# Altium schematic sheet Actuators.SchDoc: Actuators
size A3; SheetNumber: 5; SheetTotal: 10
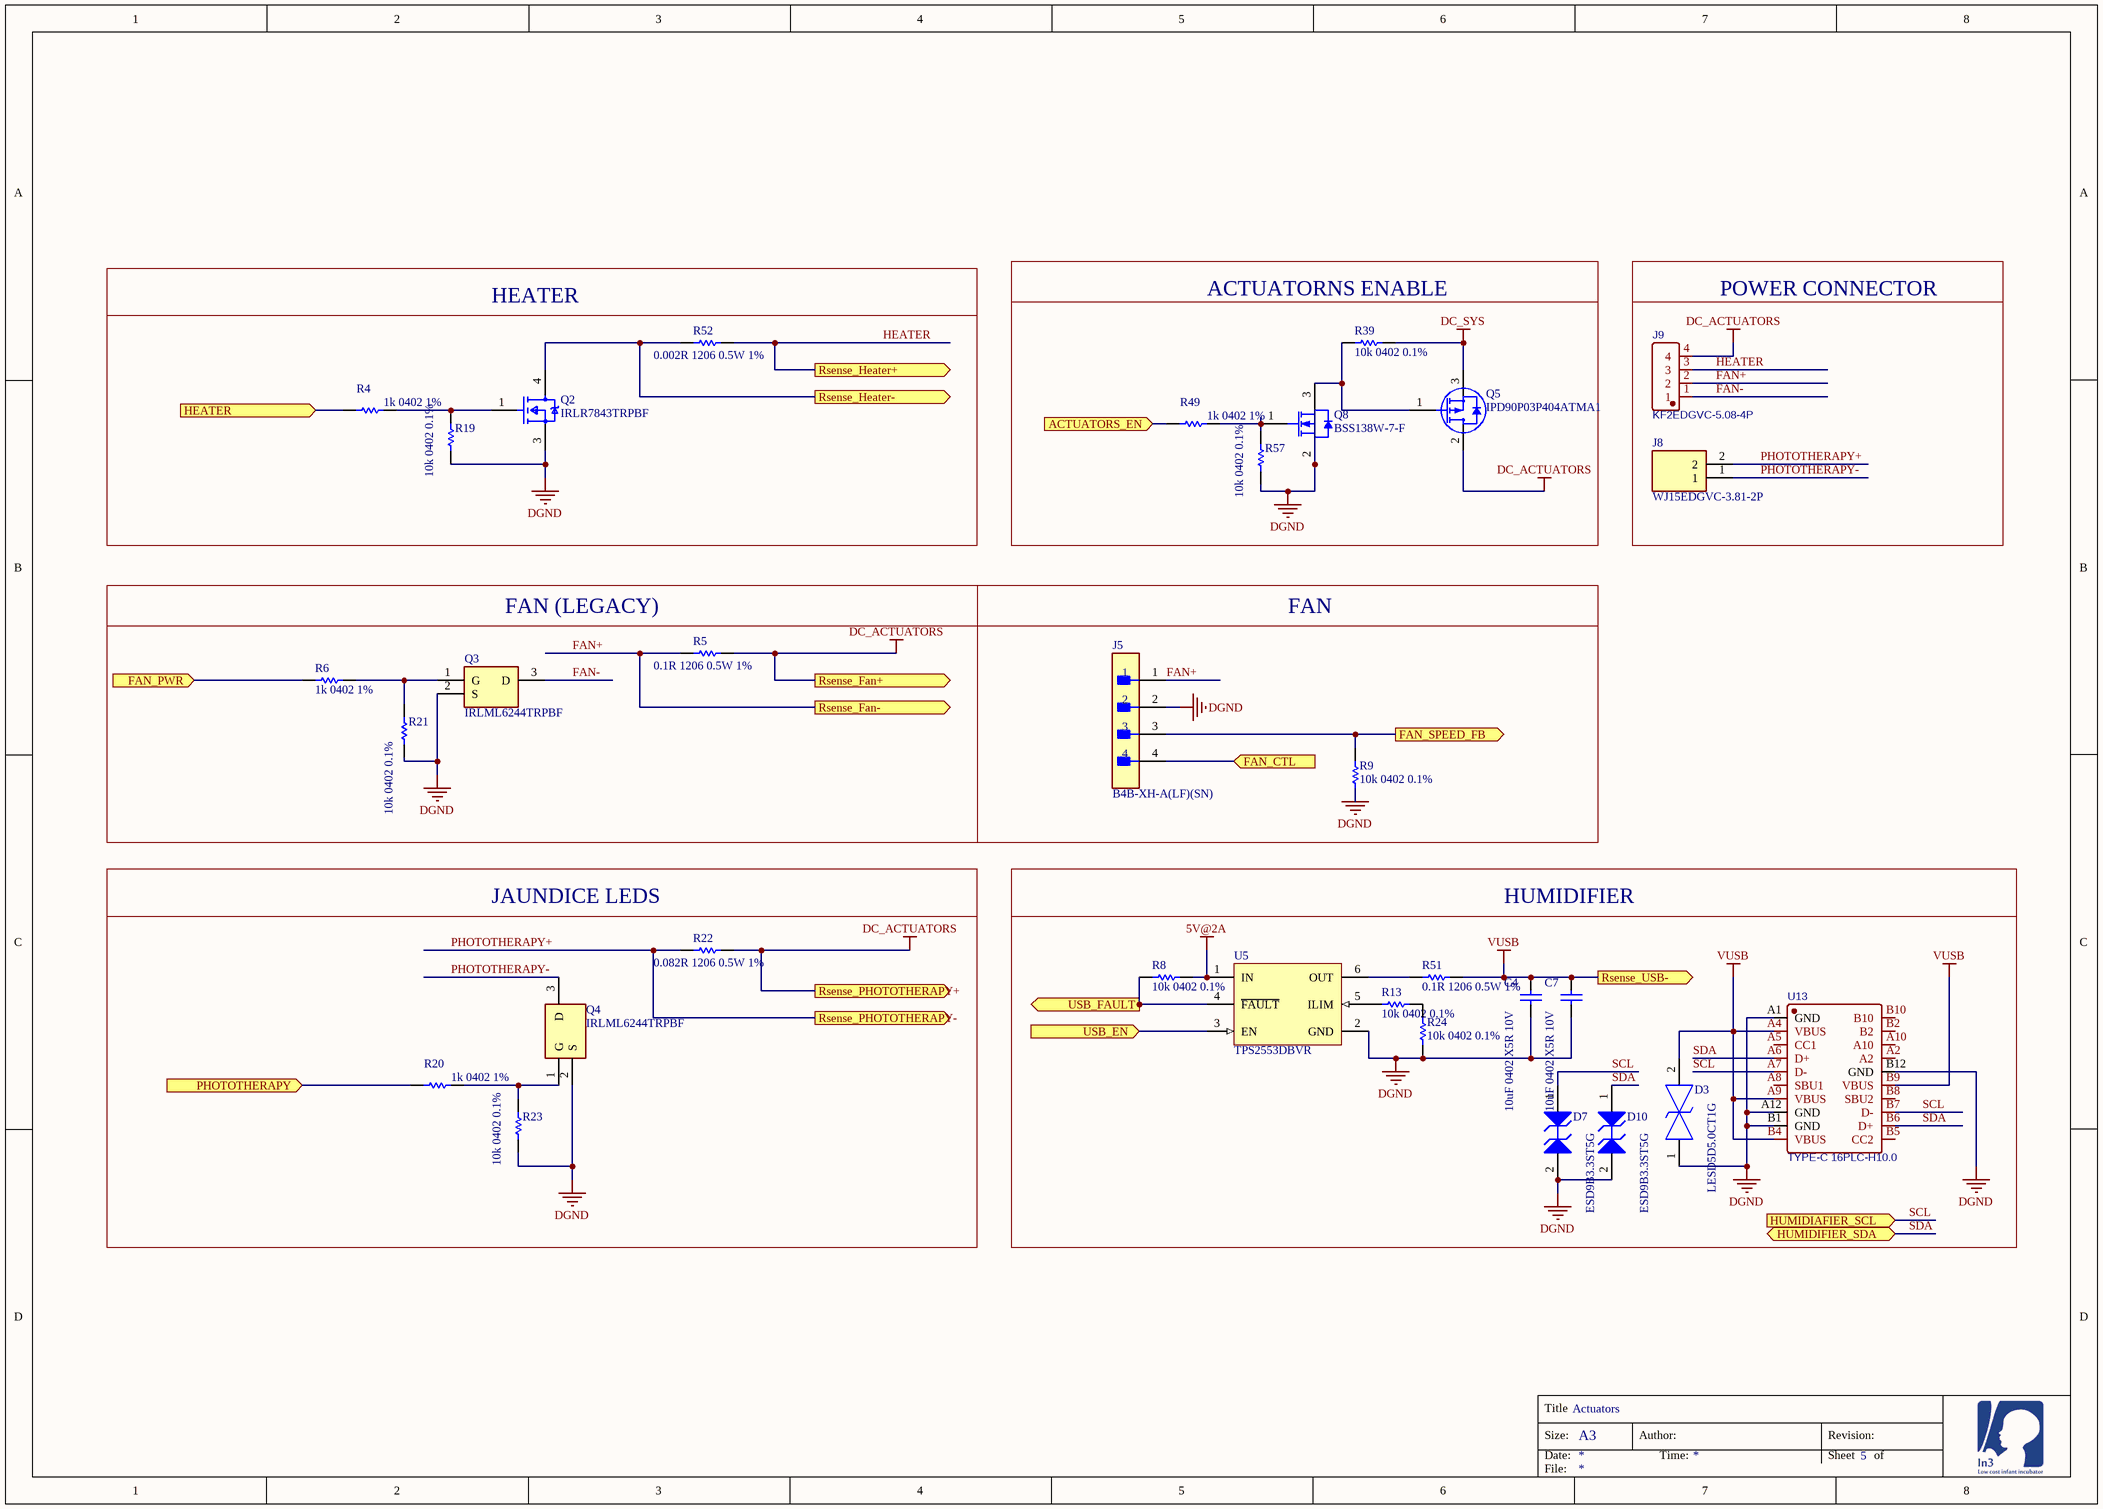
[diagram p0: Actuators.SchDoc]

## Parts
C4  10uF 0402 X5R 10V  [CAPC1005X55X25NL5T10]
C7  10uF 0402 X5R 10V  [CAPC1005X55X25NL5T10]
D3  LESD5D5.0CT1G  [LESD5D50CT1G]
D7  ESD9B3.3ST5G  [ONSC-SOD-923-2-514AB-01_V]
D10  ESD9B3.3ST5G  [ONSC-SOD-923-2-514AB-01_V]
J5  B4B-XH-A(LF)(SN)  [FP-B4B-XH-A_LF_SN-MFG]
J8  WJ15EDGVC-3.81-2P  [SHDR2W85P0X381_1X2_850X700X935P]
J9  KF2EDGVC-5.08-4P  [CONN-TH_4P-P5.08_KF2EDGVC-5.08-4P]
Q2  IRLR7843TRPBF  [FP-PG-TO252-3-MFG]
Q3  IRLML6244TRPBF  [SOT95P237X112-3N]
Q4  IRLML6244TRPBF  [SOT95P237X112-3N]
Q5  IPD90P03P404ATMA1  [DPAK IPD90P03P404ATMA1]
Q8  BSS138W-7-F  [DIOD-SOT323-3_V]
R4  1k 0402 1%  [RESC1005X40X25ML05T10]
R5  0.1R 1206 0.5W 1%  [CAPC3216X180X55ML20T25]
R6  1k 0402 1%  [RESC1005X40X25ML05T10]
R8  10k 0402 0.1%  [RESC1005X40X25ML05T10]
R9  10k 0402 0.1%  [RESC1005X40X25ML05T10]
R13  10k 0402 0.1%  [RESC1005X40X25ML05T10]
R19  10k 0402 0.1%  [RESC1005X40X25ML05T10]
R20  1k 0402 1%  [RESC1005X40X25ML05T10]
R21  10k 0402 0.1%  [RESC1005X40X25ML05T10]
R22  0.082R 1206 0.5W 1%  [CAPC3216X180X55ML20T25]
R23  10k 0402 0.1%  [RESC1005X40X25ML05T10]
R24  10k 0402 0.1%  [RESC1005X40X25ML05T10]
R39  10k 0402 0.1%  [RESC1005X40X25ML05T10]
R49  1k 0402 1%  [RESC1005X40X25ML05T10]
R51  0.1R 1206 0.5W 1%  [CAPC3216X180X55ML20T25]
R52  0.002R 1206 0.5W 1%  [CAPC3216X180X55ML20T25]
R57  10k 0402 0.1%  [RESC1005X40X25ML05T10]
U5  TPS2553DBVR  [DBV0006A_M]
U13  TYPE-C 16PLC-H10.0  [TYPE-C-TH_16PLC-H10.0]

## Blocks framed on the sheet
HEATER: Q2 R4 R19 R52
ACTUATORNS ENABLE: Q5 Q8 R39 R49 R57
POWER CONNECTOR: J8 J9
FAN: J5 R9
FAN (LEGACY): Q3 R5 R6 R21
JAUNDICE LEDS: Q4 R20 R22 R23
HUMIDIFIER: C4 C7 D3 D7 D10 R8 R13 R24 R51 U5 U13

## Ports
ACTUATORS_EN (in), FAN_CTL (in), FAN_PWR (in), FAN_SPEED_FB (out), HEATER (in), HUMIDIAFIER_SCL (in), HUMIDIFIER_SDA (bidir), PHOTOTHERAPY (in), Rsense_Fan+ (out), Rsense_Fan- (out), Rsense_Heater+ (out), Rsense_Heater- (out), Rsense_PHOTOTHERAPY+ (out), Rsense_PHOTOTHERAPY- (out), Rsense_USB- (out), USB_EN (in), USB_FAULT (out)

## Nets
5V@2A: R8.2 U5.1(IN)
DC_ACTUATORS: J9.4 Q5.2(D) R5.1 R22.1 ; port Rsense_PHOTOTHERAPY+, port Rsense_Fan+
DC_SYS: Q5.3(S) R39.1
DGND: C4.1 C7.1 D3.1 D7.2(A2) D10.2(A2) J5.2 Q2.3(SOURCE) Q3.2(S) Q4.2(S) Q8.2(S) R9.1 R19.1 R21.1 R23.1 R24.1 R57.1 U5.2(GND) U13.A1(GND) U13.A12(GND) U13.B1(GND) U13.B12(GND)
VUSB: C4.2 C7.2 D3.2 R51.2 U13.A4(VBUS) U13.A9(VBUS) U13.B4(VBUS) U13.B9(VBUS) ; port Rsense_USB-
ACTUATORS_EN: R49.2 ; port ACTUATORS_EN
FAN+: J5.1 J9.2 R5.2 ; port Rsense_Fan-
FAN-: J9.1 Q3.3(D)
FAN_CTL: J5.4 ; port FAN_CTL
FAN_PWR: R6.2 ; port FAN_PWR
FAN_SPEED_FB: J5.3 R9.2 ; port FAN_SPEED_FB
HEATER: J9.3 R52.1 ; port Rsense_Heater+
HEATER: R4.2 ; port HEATER  [a separate net that carries the same name]
PHOTOTHERAPY: R20.2 ; port PHOTOTHERAPY
PHOTOTHERAPY+: J8.2 R22.2 ; port Rsense_PHOTOTHERAPY-
PHOTOTHERAPY-: J8.1 Q4.3(D)
Rsense_Heater-: Q2.4(DRAIN) R52.2 ; port Rsense_Heater-
SCL: D7.1(A1) U13.A7(D-) U13.B7(D-) ; port HUMIDIAFIER_SCL
SDA: D10.1(A1) U13.A6(D+) U13.B6(D+) ; port HUMIDIFIER_SDA
USB_EN: U5.3(EN) ; port USB_EN
USB_FAULT: R8.1 U5.4(~{FAULT}) ; port USB_FAULT
NetQ2_1: Q2.1(GATE) R4.1 R19.2
NetQ3_1: Q3.1(G) R6.1 R21.2
NetQ4_1: Q4.1(G) R20.1 R23.2
NetQ5_1: Q5.1(G) Q8.3(D) R39.2
NetQ8_1: Q8.1(G) R49.1 R57.2
NetR13_1: R13.1 R24.2
NetR13_2: R13.2 U5.5(ILIM)
NetR51_1: R51.1 U5.6(OUT)

Not connected (* = marked no-connect by the designer): U13 A2 A5(CC1) A8(SBU1) A10 B2 B5(CC2) B8(SBU2) B10

## Notes on the sheet
- Title
- Size:
- Date:
- A3
- Author:
- Time:
- Revision:
- Sheet
- of
- File:

## Library data of the parts
C4 C7 = CMP-1662-00020-1: ComponentLink2Description: Datasheet; ComponentLink2URL: http://psearch.en.murata.com/capacitor/product/GRM155R60J105KE19%23.pdf; ComponentLink1Description: Manufacturer URL; ComponentLink1URL: http://www.murata.com/; LCSC_PN: C77000
D3 = LESD5D5.0CT1G: TVS Diode (Bi-directional); Manufacturer_Name: LRC; Height: 0.7mm; Manufacturer_Part_Number: LESD5D5.0CT1G; LCSC_PN: C383211
D7 D10 = CMP-1063-00120-1: Transient Voltage Suppressor, Micro-Packaged Diode for ESD Protection, 2-Pin SOD-923, Pb-Free, Tape and Reel; Manufacturer: On Semiconductor; Number of Lines: 1; V(BR) Min (V): 5; VRWM Max (V): 3.3; Direction: Bidirectional; ComponentLink3URL: http://www.onsemi.com/pub_link/Collateral/514AB.PDF; PartNumber: ESD9B3.3ST5G; PackageVersion: Rev. C, 03/2011; Mounting Technology: Surface Mount; PackageReference: SOD-923-2-514AB-01; RoHS: Pb-Free; DatasheetVersion: Rev. 2; ComponentLink1URL: http://www.onsemi.com/; PackageDescription: 2-Pin SOD, Body 0.8 x 0.6 mm; ComponentLink3Description: Package Specification; ComponentLink2URL: http://www.onsemi.cn/pub_link/Collateral/ESD9B-D.PDF; IR Max (uA): 1; Packing: Tape and Reel; ComponentLink2Description: Datasheet; ComponentLink1Description: Manufacturer URL; LCSC_PN: C96512
J5 = CMP-17439-000250-1: CONN HEADER VERT 4POS 2.5MM; Number of Contacts: 4; Contact Resistance: 20mR; Voltage Rating: 250V; Max Current Rating: 3A; Gender: Male; Wire/Cable Gauge: 22AWG; Mated Stacking Heights: 9.8mm; Insulation Resistance: 1GR; Orientation: Straight; Contact Type: Male Pin; Contact Finish - Mating: TIN; Series: XH; Max Voltage Rating (AC): 250V; Lead Pitch: 2.5mm; Contact Shape: Square; Insulation Color: Natural; Termination: Solder; Lead Free: Lead Free; Voltage Rating (AC): 250V; Number of Rows: 1; Flammability Rating: UL94 V-0; Number of Positions: 4; Max Operating Temperature: 85°C; Package Quantity: 500; Mount: Through Hole; REACH SVHC: No SVHC; Connector Type: Header; Insulation Material: Nylon; Fastening Type: Detent; Min Operating Temperature: -25°C; Housing Color: White; Packaging: Bulk; Contact Plating: Tin; Contact Material: Brass; Max Voltage Rating (DC): 250V; Housing Material: Polyamide; Color: Natural; Material: Polyamide; Pitch: 2.5mm; Depth: 5.75mm; Current Rating: 3A; Length: 12.4mm; LCSC_PN: C144395
J8 = WJ15EDGVC-3.81-2P: Connector; Manufacturer_Name: Ningbo Kangnex; Datasheet Link: https://datasheet.lcsc.com/szlcsc/Ningbo-Kangnex-Elec-WJ15EDGVC-3-81-2P_C8396.pdf; Height: 9.35mm; Manufacturer_Part_Number: WJ15EDGVC-3.81-2P; LCSC_PN: C8396
J9 = KF2EDGVC-5.08-4P: BOM_Manufacturer: Cixi Kefa Elec; Contributor: LCSC; BOM_Supplier: LCSC; BOM_Supplier Part: C441388; BOM_Manufacturer Part: KF2EDGVC-5.08-4P; BOM_JLCPCB Part Class: Extended Part; spicePre: C; spiceSymbolName: KF2EDGVC-5.08-4P; LCSC_PN: C441388
Q2 = CMP-32901-000143-1: MOSFET N-CH 30V 161A DPAK; Manufacturer: Infineon; Drain To Source Resistance: 3.2mΩ; Depletion Mode: False; Reverse Recovery Time: 39ns; Reverse Recovery Charge: 36nC; Threshold Vgs Max: 2.3V; Rthja Max: 50°C/W; Threshold Vgs Min: 1.4V; Power Dissipation: 140W; Pulse Drain Current: 620A; Input Capacitace At Vds: 4380pF @ 15V; Turn On Delay Time: 25ns; Gate To Source Voltage: 20V; Max Forward Diode Voltage: 1V; Gate Charge At Vgs: 34nC @ 4.5V; Max Junction Temp: +175°C; Number Of Channels: 1; Turn Off Delay Time: 34ns; ComponentLink2URL: https://www.infineon.com/dgdl/irlr7843pbf.pdf?fileId=5546d462533600a40153566de53526d8; Temperature Range High: +175°C; Octopart: https://octopart.com/irlr7843trpbf-infineon-65875062; Temperature: -55°C to +175°C; Device Class L3: MOSFETs; Manufacturer Part Number: IRLR7843TRPBF; Category: Trans; Package: PG-TO252-3; Footprint Url: https://www.infineon.com/cms/en/product/packages/PG-TO252/PG-TO252-3-901/; Continuous Drain Current: 161A; Digikey Description: MOSFET N-CH 30V 161A DPAK; Automotive: No; Lead Free: Yes; Drain To Source Breakdown Voltage: 30V; Height: 2.52mm; Temperature Range Low: -55°C; RoHS: TRUE; Number Of N Channels: 1; Drain To Source Voltage: 30V; ComponentLink2Description: Datasheet; Device Class L2: Transistors; Device Class L1: Discrete Semiconductors; LCSC_PN: C21988
Q3 Q4 = IRLML6244TRPBF: Transistor; Manufacturer_Name: Infineon; Datasheet Link: http://www.infineon.com/dgdl/irlml6244pbf.pdf?fileId=5546d462533600a4015356686fed261f; Height: 1.12mm; Manufacturer_Part_Number: IRLML6244TRPBF; Mouser Part Number: 942-IRLML6244TRPBF; Mouser Price/Stock: https://www.mouser.co.uk/ProductDetail/Infineon-IR/IRLML6244TRPBF?qs=9%252BKlkBgLFf1HkY%2F2U%252BIhLQ%3D%3D; Arrow Part Number: IRLML6244TRPBF; Arrow Price/Stock: https://www.arrow.com/en/products/irlml6244trpbf/infineon-technologies-ag?region=nac; LCSC_PN: C143946
Q5 = CMP-3103264-6: Single P-Channel 30 V 4.5 mOhm 100 nC OptiMOS Power Mosfet - TO-252-3-11; Lead-Free Status: Lead Free; REACH SVHC Compliance: No SVHC; Octopart URL: https://octopart.com/ipd90p03p404atma1-infineon-21386769; Polarity: P-Channel; RoHS: Compliant; Mounting Style: Surface Mount; Operating Temperature: 175 °C (max); Packaging: Reel; Number of Pins: 3; OctopartID: f6ad3ee185da296a; Manufacturer Part Number: IPD90P03P404ATMA1; Manufacturer Part Number 2: WSF70P03; LCSC_PN: C148439
Q8 = CMP-2000-05968-1: N-Channel Enhancement Mode Mosfet, 50 V, 200 mA, -55 to 150 degC, 6-Pin SOT-323, RoHS, Tape and Reel; Typical Turn-Off Delay Time: 20ns; Number of Channels: 1Channel; Type: EnhancementModeFieldEffectTransistor; Brand: DiodesIncorporated; Vds - Drain-Source Breakdown Voltage: 75V; Vgs - Gate-Source Voltage: 20V; Rds On - Drain-Source Resistance: 1.4Ohms; Transistor Type: 1N-Channel; Configuration: Single; Unit Weight: 0.000212oz; Pd - Power Dissipation: 200mW; Id - Continuous Drain Current: 200mA; Forward Transconductance - Min: 0.1S; Manufacturer URL: http://www.diodes.com/; Series: BSS138; Package Description: 3-Pin Small Outline Transistor, Body 2 x 1.25 mm, Pitch 0.65 mm; Mounting Technology: SurfaceMount; Product Category: MOSFET; RoHS: True; Maximum Operating Temperature: +150C; Height: 1mm; Length: 2.2mm; Technology: Si; Width: 1.35mm; Datasheet URL: http://www.diodes.com/_files/datasheets/ds30206.pdf; Manufacturer: DiodesIncorporated; Package / Case: SOT-323-3; Typical Turn-On Delay Time: 20ns; Transistor Polarity: N-Channel; Factory Pack Quantity: 3000; Packaging: Reel; Product: MOSFETSmallSignal; Datasheet Version: Rev. 11-2, 09/2013; Package Reference: SOT323; Minimum Operating Temperature: -55C; Mounting Style: SMD/SMT; Channel Mode: Enhancement; LCSC_PN: C24553
R4 R6 R8 R9 R13 R19-R21 R23 R24 R39 R49 R57 = CMP-2002-07472-1
  R4 R6 R20 R49: LCSC_PN: C106235
  R8 R9 R13 R19 R21 R23 R24 R39 R57: LCSC_PN: C190095
R5 R22 R51 = CMP-0abdc173b10ad57a-1: Manufacturer Part Number: WSLP12065L000FEA; Resistance: 0,1; Power: 1W; Octopart URL: https://octopart.com/1-2176055-0-te+connectivity-46440145; Case/Package: 1206; Lifecycle Status: Not Listed by Manufacturer; Packaging: Tape & Reel (TR); OctopartID: 0abdc173b10ad57a
  R5 R51: LCSC_PN: C601090
  R22: LCSC_PN: C705560
R52 = CMP-0abdc173b10ad57a-1: Manufacturer Part Number: WSLP12065L000FEA; Resistance: 0,002; Power: 1W; Octopart URL: https://octopart.com/1-2176055-0-te+connectivity-46440145; Case/Package: 1206; Lifecycle Status: Not Listed by Manufacturer; Packaging: Tape & Reel (TR); OctopartID: 0abdc173b10ad57a; OrderingCode: WSLP12065L000FEA; Manufacturer Part Number 2: FMF06FTHR005-LHL; LCSC_PN: C601094
U5 = CMP-0337-00284-2: Adjustable, Active High, Constant-Current, Current-Limited Power-Distribution Switch, 0.075 to 1.7 A Current Limit, -40 to 85 degC, 6-pin SOT-23 (DBV), Green (RoHS & no Sb/Br); Manufacturer: Texas Instruments; Continuous Current(Max)(A): 1.5; Vin(Min)(V): 2.5; Current Limit Accuracy @ 1A: +/-7.5% (925mA min / 1075mA max); Vin(Max)(V): 6.5; Rating: Catalog; rDS(on) per FET(Typ)(mOhms): 100/DRV, 85/DBV; Number of Switches: 1; ComponentLink1Description: Datasheet; PartNumber: TPS2553DBVR; Enable: Active High; PackageDescription: 6-Pin Plastic Small-Outline Package, 2.9 x 1.6 mm Body, 0.95 mm Pitch, 2.8 mm Lead Span; DatasheetVersion: SLVS841E; Code_JEDEC: MO-178-AB*; Current Limit Topology: Constant-Current; Mounting Technology: Surface Mount; Eco-Plan: Green (RoHS & no Sb/Br); PackageVersion: revK, Mar-2006; PackageReference: DBV0006A; ComponentLink1URL: http://www.ti.com/general/docs/lit/getliterature.tsp?genericPartNumber=TPS2553&fileType=pdf; Current Limit(A): 0.075 to 1.7; LCSC_PN: C55266
U13 = TYPE-C 16PLC-H10.0: Manufacturer: SHOU HAN(首韩); Contributor: lcsc; Supplier: LCSC; Supplier Part: C3151747; Manufacturer Part: TYPE-C 16PLC-H10.0; JLCPCB Part Class: Extended Part; spicePre: U; spiceSymbolName: TYPE-C 16PLC-H10.0; LCSC_PN: C3151747